# EAGLE schematic ServoBooster (EAGLE 6.1)
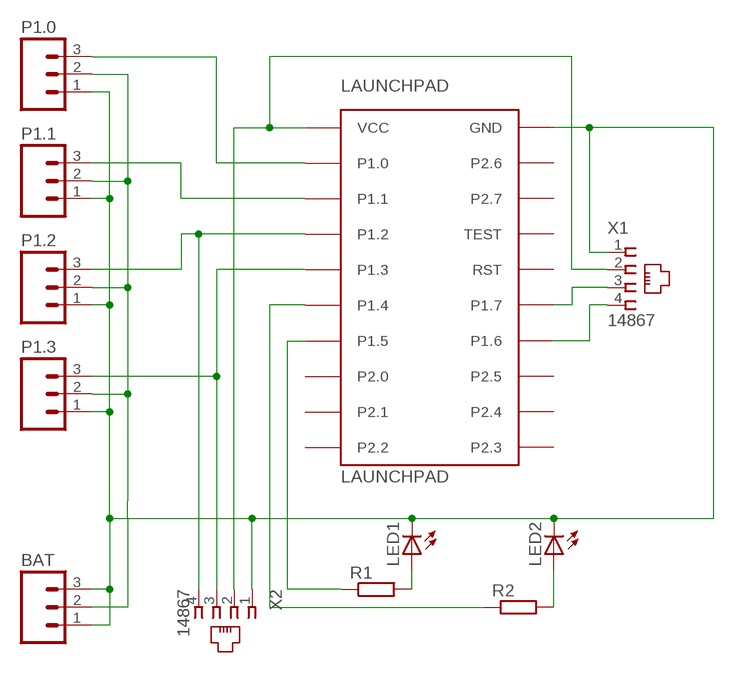
[diagram p0: schematic, sheet 1]

## Parts
BAT  M03PTH  [1X03]
LAUNCHPAD  LAUNCHPAD  [LAUNCHPAD]
LED1  LED5MM  [LED5MM]
LED2  LED5MM  [LED5MM]
P1.0  M03PTH  [1X03]
P1.1  M03PTH  [1X03]
P1.2  M03PTH  [1X03]
P1.3  M03PTH  [1X03]
R1  R-EU_0207/10  [0207/10]
R2  R-EU_0207/10  [0207/10]
X1  14867  [14867]
X2  14867  [14867]

## Nets
GND: BAT.1 BAT.2 BAT.3 LAUNCHPAD.GND LED1.K(C) LED2.K(C) P1.0.1 P1.1.1 P1.2.1 P1.3.1 X1.1 X2.1
N$2: LAUNCHPAD.P1.7 X1.3
N$3: LAUNCHPAD.P1.0 P1.0.3
N$4: LAUNCHPAD.P1.1 P1.1.3
N$5: LAUNCHPAD.P1.2 P1.2.3 X2.4
N$6: LAUNCHPAD.P1.3 P1.3.3 X2.3
N$7: LAUNCHPAD.P1.6 X1.4
N$9: LED1.A R1.2
N$10: LED2.A R2.2
N$11: LAUNCHPAD.P1.5 R1.1
N$12: LAUNCHPAD.P1.4 R2.1
VBAT: P1.0.2 P1.1.2 P1.2.2 P1.3.2
VCC: LAUNCHPAD.VCC X1.2 X2.2
Unconnected: LAUNCHPAD.P2.0 LAUNCHPAD.P2.1 LAUNCHPAD.P2.2 LAUNCHPAD.P2.3 LAUNCHPAD.P2.4 LAUNCHPAD.P2.5 LAUNCHPAD.P2.6 LAUNCHPAD.P2.7 LAUNCHPAD.RST LAUNCHPAD.TEST

## Library data of the parts
BAT P1.0 P1.1-P1.3 = SparkFun:M03: Header 3 Standard 3-pin 0.1" header. Use with straight break away headers (SKU : PRT-00116), right angle break away headers (PRT-00553), swiss pins (PRT-00743), machine pins (PRT-00117), and female headers (PRT-00115). Molex polarized connector foot print use with SKU : PRT-08232 with associated crimp pins and housings.
LAUNCHPAD = TI_launchpad:LAUNCHPAD: MSP-EXP430G2 LaunchPad Booster Pack layouts. LAUNCHPAD: Full-size board LAUNCHPAD-50MM: 50x50mm board covering the button area LAUNCHPAD-50MM-LEFT: 50x50mm board leaving the button area open. Tall LaunchPad components marked on Reference for reference.
LED1 LED2 = led:LED: LED OSRAM: - CHIPLED LG R971, LG N971, LY N971, LG Q971, LY Q971, LO R971, LY R971 LH N974, LH R974 LS Q976, LO Q976, LY Q976 LO Q996 - Hyper CHIPLED LW Q18S LB Q993, LB Q99A, LB R99A - SideLED LS A670, LO A670, LY A670, LG A670, LP A670 LB A673, LV A673, LT A673, LW A673 LH A674 LY A675 LS A676, LA A676, LO A676, LY A676, LW A676 LS A679, LY A679, LG A679 - Hyper Micro SIDELED® LS Y876, LA Y876, LO Y876, LY Y876 LT Y87S - SmartLED LW L88C, LW L88S LB L89C, LB L89S, LG L890 LS L89K, LO L89K, LY L89K LS L896, LA L896, LO L896, LY L896 - TOPLED LS T670, LO T670, LY T670, LG T670, LP T670 LSG T670, LSP T670, LSY T670, LOP T670, LYG T670 LG T671, LOG T671, LSG T671 LB T673, LV T673, LT T673, LW T673 LH T674 LS T676, LA T676, LO T676, LY T676, LB T676, LH T676, LSB T676, LW T676 LB T67C, LV T67C, LT T67C, LS T67K, LO T67K, LY T67K, LW E67C LS E67B, LA E67B, LO E67B, LY E67B, LB E67C, LV E67C, LT E67C LW T67C LS T679, LY T679, LG T679 LS T770, LO T770, LY T770, LG T770, LP T770 LB T773, LV T773, LT T773, LW T773 LH T774 LS E675, LA E675, LY E675, LS T675 LS T776, LA T776, LO T776, LY T776, LB T776 LHGB T686 LT T68C, LB T68C - Hyper Mini TOPLED® LB M676 - Mini TOPLED Santana® LG M470 LS M47K, LO M47K, LY M47K Source: http://www.osram.convergy.de LUXEON: - LUMILED® LXK2-PW12-R00, LXK2-PW12-S00, LXK2-PW14-U00, LXK2-PW14-V00 LXK2-PM12-R00, LXK2-PM12-S00, LXK2-PM14-U00 LXK2-PE12-Q00, LXK2-PE12-R00, LXK2-PE12-S00, LXK2-PE14-T00, LXK2-PE14-U00 LXK2-PB12-K00, LXK2-PB12-L00, LXK2-PB12-M00, LXK2-PB14-N00, LXK2-PB14-P00, LXK2-PB14-Q00 LXK2-PR12-L00, LXK2-PR12-M00, LXK2-PR14-Q00, LXK2-PR14-R00 LXK2-PD12-Q00, LXK2-PD12-R00, LXK2-PD12-S00 LXK2-PH12-R00, LXK2-PH12-S00 LXK2-PL12-P00, LXK2-PL12-Q00, LXK2-PL12-R00 Source: www.luxeon.com KINGBRIGHT: KA-3528ASYC Source: www.kingbright.com
R1 R2 = resistor:R-EU_: RESISTOR, European symbol
X1 X2 = con-4ucon:14867: RJ11 Connector Source: 4UCON TECHNOLOGY INC. 14867.pdf; OC_FARNELL: unknown; OC_NEWARK: unknown